# Altium schematic sheet Moo_Sensors.SchDoc
size A
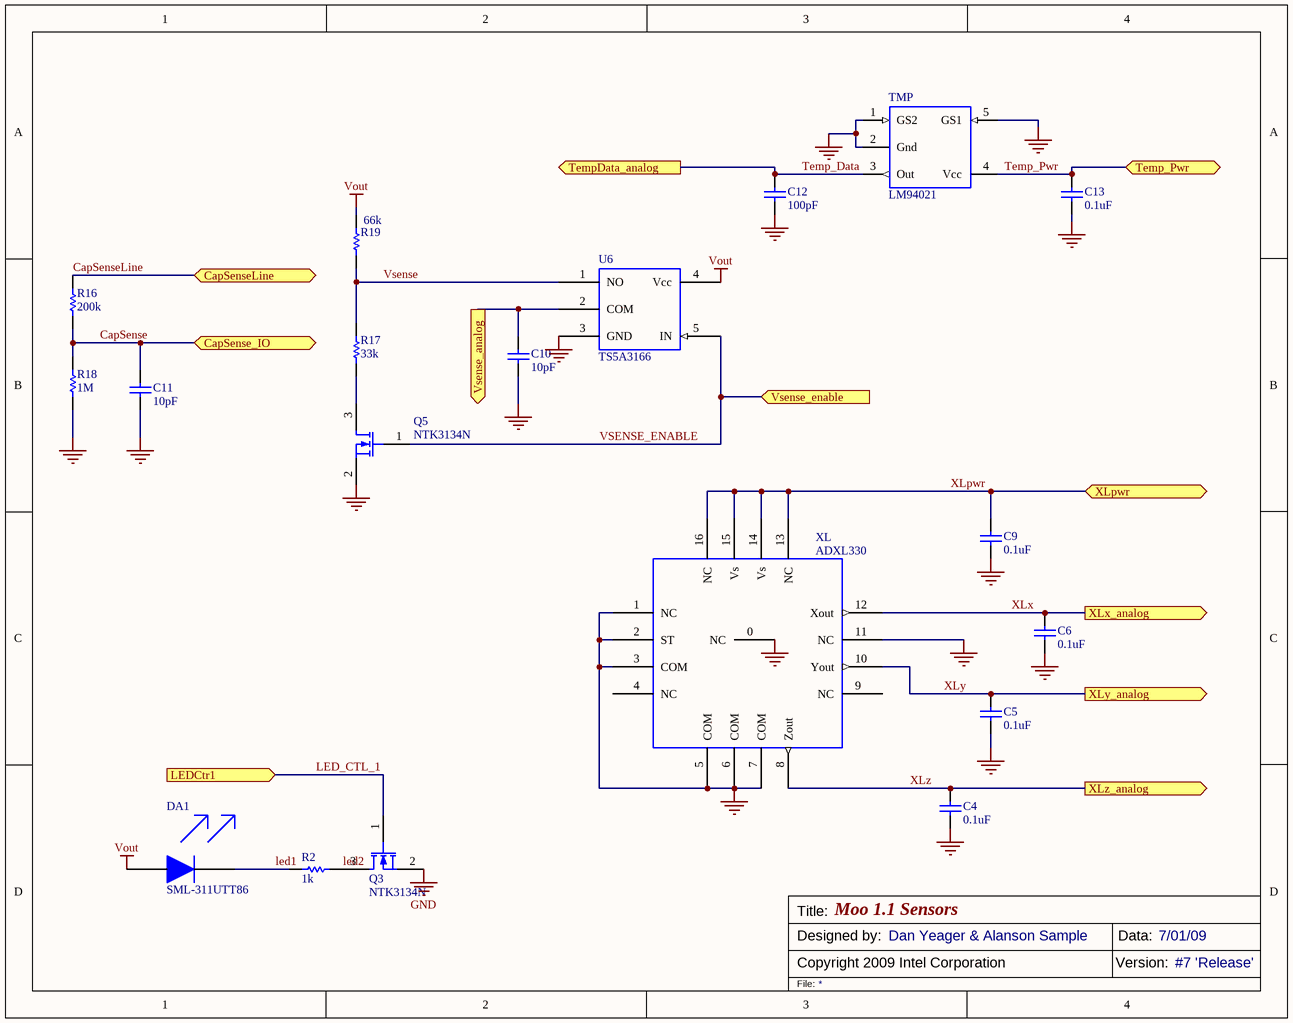
[diagram p0: Moo_Sensors.SchDoc]

## Parts
C4  value 0.1uF  [0402]  (hidden comment: Ceramic_Chip_Capacitor)
C5  value 0.1uF  [0402]  (hidden comment: Ceramic_Chip_Capacitor)
C6  value 0.1uF  [0402]  (hidden comment: Ceramic_Chip_Capacitor)
C9  value 0.1uF  [0402]  (hidden comment: Ceramic_Chip_Capacitor)
C10  value 10pF  [0402]  (hidden comment: Ceramic_Chip_Capacitor)
C11  value 10pF  [0402]  (hidden comment: Ceramic_Chip_Capacitor)
C12  value 100pF  [0402]  (hidden comment: Ceramic_Chip_Capacitor)
C13  value 0.1uF  [0402]  (hidden comment: Ceramic_Chip_Capacitor)
DA1  SML-311UTT86  [LED-0603]
Q3  NTK3134N  [SOT723]
Q5  NTK3134N  [SOT723]
R2  value 1k  [0402]  (hidden comment: Thick Film Chip Resistor)
R16  value 200k  [0402]  (hidden comment: Thick Film Chip Resistor)
R17  value 33k  [0402]  (hidden comment: Thick Film Chip Resistor)
R18  value 1M  [0402]  (hidden comment: Thick Film Chip Resistor)
R19  value 66k  [0402]  (hidden comment: Thick Film Chip Resistor)
TMP  LM94021  [SC70]
U6  TS5A3166  [sc70-5]
XL  ADXL330  [16-QFN]

## Ports
CapSense_IO, CapSenseLine, LEDCtr1 (in), Temp_Pwr, TempData_analog (out), Vsense_analog (out), Vsense_enable (in), XLpwr, XLx_analog (out), XLy_analog (out), XLz_analog (out)

## Nets
GND: C4.1 C5.1 C6.2 C9.1 C10.2 C11.2 C12.1 C13.1 Q3.2(S) Q5.2(S) R18.2 TMP.1(GS2) TMP.2(Gnd) TMP.5(GS1) U6.3(GND) XL.0(NC) XL.1(NC) XL.2(ST) XL.3(COM) XL.5(COM) XL.6(COM) XL.7(COM) XL.11(NC)
Vout: DA1.1 R19.1 U6.4(Vcc)
CapSense: C11.1 R16.2 R18.1 ; port CapSense_IO
CapSenseLine: R16.1 ; port CapSenseLine
led1: DA1.2 R2.1
led2: Q3.3(D) R2.2
LED_CTL_1: Q3.1(G) ; port LEDCtr1
Temp_Data: C12.2 TMP.3(Out) ; port TempData_analog
Temp_Pwr: C13.2 TMP.4(Vcc) ; port Temp_Pwr
Vsense: R17.1 R19.2 U6.1(NO)
Vsense_analog: C10.1 U6.2(COM) ; port Vsense_analog
VSENSE_ENABLE: Q5.1(G) U6.5(IN) ; port Vsense_enable
XLpwr: C9.2 XL.13(NC) XL.14(Vs) XL.15(Vs) XL.16(NC) ; port XLpwr
XLx: C6.1 XL.12(Xout) ; port XLx_analog
XLy: C5.2 XL.10(Yout) ; port XLy_analog
XLz: C4.2 XL.8(Zout) ; port XLz_analog
NetQ5_3: Q5.3(D) R17.2

Not connected (* = marked no-connect by the designer): XL 4(NC) 9(NC)

## Notes on the sheet
- Title:
- Copyright 2009 Intel Corporation
- Designed by:
- Moo 1.1 Sensors
- Dan Yeager & Alanson Sample
- Version:
- Data:
- 7/01/09
- #7 'Release'
- File:

## Library data of the parts
C4-C6 C9 C10 C12 C13 = Ceramic_Chip_Capacitor: Ceramic Capacitor - Standard; Note: Footprint corresponds to dimensions for bulk cassette packaging. This case size has tightened tolerances.
C11 = Ceramic_Chip_Capacitor: Ceramic Capacitor - Standard; Note: Do Not Stuff
DA1 = SML-311UTT86: LED 630NM RED WTR CLR 0603 SMD
Q3 Q5 = NTK3134N: Powe Mosfet 20V, 890mA, Single N-channel
R2 R16-R19 = Thick Film Chip Resistor: Note: Do Not Stuff
TMP = LM94021: Temperature Sensor
U6 = TS5A3166: TI Analog Switch 100nA 1ohm Normally Open
XL = ADXL330k: Analog Devices 3D Accelerometer